# Altium schematic sheet NexitonAdapterBoard.SchDoc
size Tabloid
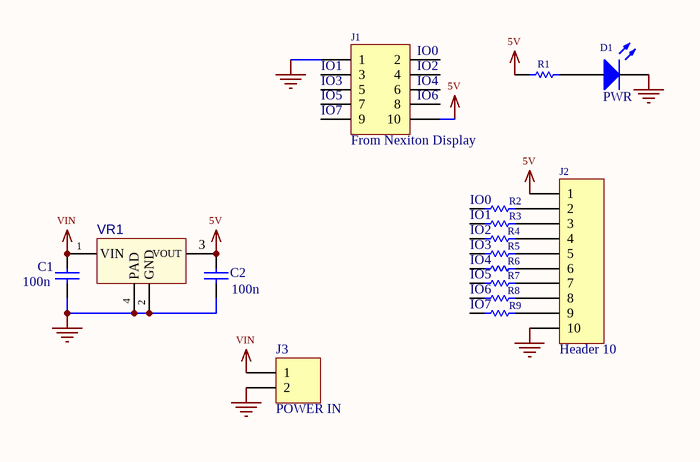
[diagram p0: NexitonAdapterBoard.SchDoc]

## Parts
C1  value 100n  [RES_0805]  (hidden comment: Cap Semi)
C2  value 100n  [RES_0805]  (hidden comment: Cap Semi)
D1  PWR  [LED-0805]
J1  From Nexiton Display  [HDR2X5]
J2  Header 10  [HDR1X10]
J3  POWER IN  [HDR1X2]
R1  Res1  [RESC0805(2012)_M]  (value not drawn)
R2  Res1  [RESC0805(2012)_M]  (value not drawn)
R3  Res1  [RESC0805(2012)_M]  (value not drawn)
R4  Res1  [RESC0805(2012)_M]  (value not drawn)
R5  Res1  [RESC0805(2012)_M]  (value not drawn)
R6  Res1  [RESC0805(2012)_M]  (value not drawn)
R7  Res1  [RESC0805(2012)_M]  (value not drawn)
R8  Res1  [RESC0805(2012)_M]  (value not drawn)
R9  Res1  [RESC0805(2012)_M]  (value not drawn)
VR1  LDL1117S50R  [SOT223_M]  (value not drawn)

## Nets
5V: C2.2 J1.10 J2.1 R1.1 VR1.3(VOUT)
GND: C1.1 C2.1 D1.2(+) J1.1 J2.10 J3.2 VR1.2(GND) VR1.4(PAD)
VIN: C1.2 J3.1 VR1.1(VIN)
IO0: J1.2 R2.1
IO1: J1.3 R3.1
IO2: J1.4 R4.1
IO3: J1.5 R5.1
IO4: J1.6 R6.1
IO5: J1.7 R7.1
IO6: J1.8 R8.1
IO7: J1.9 R9.1
NetD1_1: D1.1(-) R1.2
NetJ2_2: J2.2 R2.2
NetJ2_3: J2.3 R3.2
NetJ2_4: J2.4 R4.2
NetJ2_5: J2.5 R5.2
NetJ2_6: J2.6 R6.2
NetJ2_7: J2.7 R7.2
NetJ2_8: J2.8 R8.2
NetJ2_9: J2.9 R9.2

## Library data of the parts
C1 C2 = Cap Semi: Capacitor (Semiconductor SIM Model); Published: 8-Jun-2000; LatestRevisionDate: 29-May-2009; LatestRevisionNote: IPC-7351 Footprint Added.; PackageReference: C1206; Publisher: Altium Limited; PackageDescription: Chip Capacitor
D1 = LED0: Published: 8-Jun-2000; LatestRevisionDate: 08-Jul-2005; LatestRevisionNote: Mech Layer 1 removed.; PackageReference: LED-0; Publisher: Altium Limited; PackageDescription: LED; 2 Leads
J1 = Header 5X2: Header, 5-Pin, Dual row; LatestRevisionDate: 17-Jul-2002; LatestRevisionNote: Re-released for DXP Platform.; Publisher: Altium Limited
J2 = Header 10: Header, 10-Pin; LatestRevisionDate: 17-Jul-2002; LatestRevisionNote: Re-released for DXP Platform.; Publisher: Altium Limited
J3 = Header 2: Header, 2-Pin; LatestRevisionDate: 17-Jul-2002; LatestRevisionNote: Re-released for DXP Platform.; Publisher: Altium Limited
R1-R9 = Res1: Resistor; Value: 1K; Published: 8-Jun-2000; LatestRevisionDate: 17-Jul-2002; LatestRevisionNote: Re-released for DXP Platform.; PackageReference: AXIAL-0.3; Publisher: Altium Limited; PackageDescription: Axial Device, Thru-Hole; 2 Leads; 0.3 in Pin Spacing
VR1 = LM317: Fixed 5V Voltage Regulator; MFR: TI; MPN: LM340MP-5.0; ComponentLink1URL: http://www.ti.com/general/docs/lit/getliterature.tsp?genericPartNumber=tlv1117-50&fileType=pdf; ComponentLink1Description: Datasheet